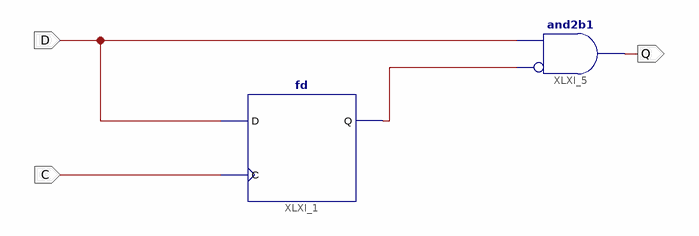
[diagram p0: schematic sheet 1]
// Xilinx ISE schematic Debounce1b.sch (spartan3e) as structural Verilog: 2 symbols, 3 ports
module Debounce1b (
  input  D,
  input  C,
  output Q
);

  wire XLXN_11;

  fd XLXI_1 (.C(C), .D(D), .Q(XLXN_11));
  and XLXI_5 (Q, ~XLXN_11, D);  // and2b1
endmodule
